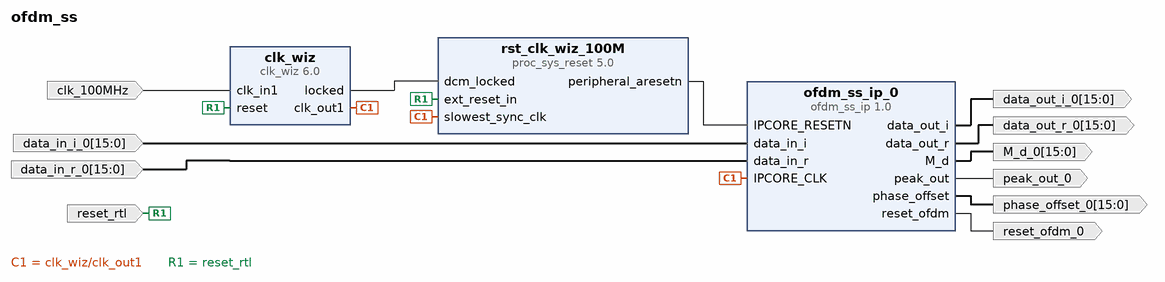
[diagram p0: block diagram of the top level]
# Vivado block design ofdm_ss, xc7z010clg400-1, Vivado 2023.2
create_bd_design ofdm_ss

create_bd_port -dir I -type clk clk_100MHz
set_property -dict {CONFIG.FREQ_HZ 100000000} [get_bd_ports clk_100MHz]
create_bd_port -dir I -type rst reset_rtl
set_property -dict {CONFIG.POLARITY ACTIVE_HIGH} [get_bd_ports reset_rtl]
create_bd_port -dir O -from 15 -to 0 M_d_0
create_bd_port -dir I -from 15 -to 0 data_in_i_0
create_bd_port -dir I -from 15 -to 0 data_in_r_0
create_bd_port -dir O -from 15 -to 0 data_out_i_0
create_bd_port -dir O -from 15 -to 0 data_out_r_0
create_bd_port -dir O peak_out_0
create_bd_port -dir O -from 15 -to 0 phase_offset_0
create_bd_port -dir O reset_ofdm_0

create_bd_cell -type ip -vlnv user.org:ip:ofdm_ss_ip:1.0 ofdm_ss_ip_0
create_bd_cell -type ip -vlnv xilinx.com:ip:clk_wiz:6.0 clk_wiz
create_bd_cell -type ip -vlnv xilinx.com:ip:proc_sys_reset:5.0 rst_clk_wiz_100M

# ---- connections ----

connect_bd_net [get_bd_ports clk_100MHz] [get_bd_pins clk_wiz/clk_in1]
connect_bd_net [get_bd_pins clk_wiz/clk_out1] [get_bd_pins rst_clk_wiz_100M/slowest_sync_clk] [get_bd_pins ofdm_ss_ip_0/IPCORE_CLK]
connect_bd_net [get_bd_pins clk_wiz/locked] [get_bd_pins rst_clk_wiz_100M/dcm_locked]
connect_bd_net -net data_in_i_0_1 [get_bd_ports data_in_i_0] [get_bd_pins ofdm_ss_ip_0/data_in_i]
connect_bd_net -net data_in_r_0_1 [get_bd_ports data_in_r_0] [get_bd_pins ofdm_ss_ip_0/data_in_r]
connect_bd_net [get_bd_pins ofdm_ss_ip_0/M_d] [get_bd_ports M_d_0]
connect_bd_net [get_bd_pins ofdm_ss_ip_0/data_out_i] [get_bd_ports data_out_i_0]
connect_bd_net [get_bd_pins ofdm_ss_ip_0/data_out_r] [get_bd_ports data_out_r_0]
connect_bd_net [get_bd_pins ofdm_ss_ip_0/peak_out] [get_bd_ports peak_out_0]
connect_bd_net [get_bd_pins ofdm_ss_ip_0/phase_offset] [get_bd_ports phase_offset_0]
connect_bd_net [get_bd_pins ofdm_ss_ip_0/reset_ofdm] [get_bd_ports reset_ofdm_0]
connect_bd_net [get_bd_ports reset_rtl] [get_bd_pins clk_wiz/reset] [get_bd_pins rst_clk_wiz_100M/ext_reset_in]
connect_bd_net [get_bd_pins rst_clk_wiz_100M/peripheral_aresetn] [get_bd_pins ofdm_ss_ip_0/IPCORE_RESETN]

validate_bd_design
save_bd_design
